# Altium schematic sheet schematic.SchDoc
size A; SheetNumber: 1; SheetTotal: 1
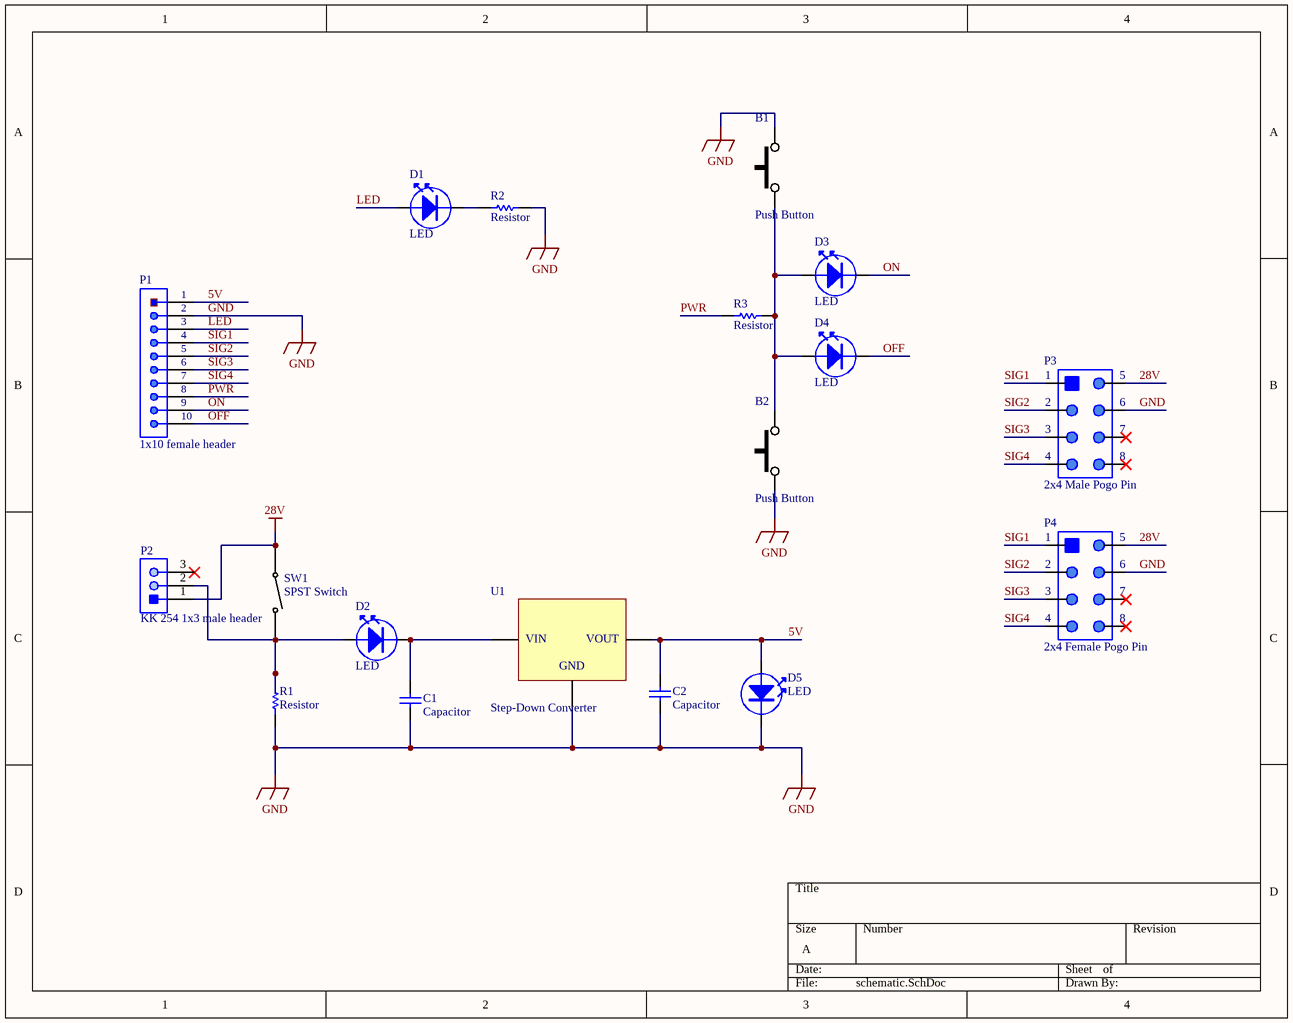
[diagram p0: schematic.SchDoc]

## Parts
B1  Push Button
B2  Push Button
C1  Capacitor
C2  Capacitor
D1  LED
D2  LED
D3  LED
D4  LED
D5  LED
P1  1x10 female header
P2  KK 254 1x3 male header
P3  2x4 Male Pogo Pin
P4  2x4 Female Pogo Pin
R1  Resistor
R2  Resistor
R3  Resistor
SW1  SPST Switch
U1  Step-Down Converter

## Nets
28V: P2.1 SW1.1
GND: C1.1 C2.1 D5.K R1.2 R2.1
5V: C2.2 D5.A
LED: D1.A
OFF: D4.K
ON: D3.K
PWR: R3.2
NetC1_2: C1.2 D2.K
NetD1_K: D1.K R2.2
NetD2_A: D2.A P2.2 R1.1 SW1.2
NetD3_A: D3.A D4.A R3.1

Not connected (* = marked no-connect by the designer): P2 3*

## Notes on the sheet
- (in symbol 1x10 female header) 1; 2; 3; 4; 5; 6; 7; 8; 9; 10
- (in symbol 2x4 Female Pogo Pin) 1; 5; 2; 6; 3; 7; 4; 8
- (in symbol 2x4 Male Pogo Pin) 1; 5; 2; 6; 3; 7; 4; 8
- (in symbol Step-Down Converter) VIN; VOUT; GND

## Library data of the parts
P1 = 1x10 female header: 5-535541-8
P2 = KK 254 1x3 male header: 22112032
P3 = 2x4 Male Pogo Pin: 826-22-008-00-005000
P4 = 2x4 Female Pogo Pin: 430-10-208-00-240000
U1 = Step-Down Converter: R-78E5.0-1.0